# Altium schematic sheet USB3 Connector.SchDoc
size 209 x 297 mm; Author: ALTIUM GOSTBOM2.0 KEV; SheetNumber: 48; SheetTotal: 48
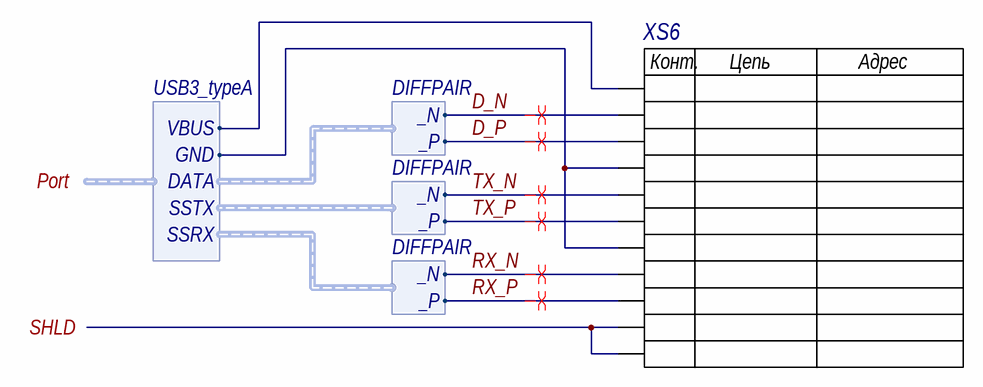
[diagram p0: USB3 Connector.SchDoc]

## Parts
XS6  10117835  [FCI-10117835_V]  (value not drawn)

## Ports
Port (harness USB3_typeA), SHLD

## Harnesses
DIFFPAIR: _P, _N
USB3_typeA: VBUS, DATA, SSTX, SSRX, GND

## Nets
D_N: XS6.2(D-) ; harness DIFFPAIR._N
D_P: XS6.3(D+) ; harness DIFFPAIR._P
RX_N: XS6.8(STDA_SSRX-) ; harness DIFFPAIR._N
RX_P: XS6.9(STDA_SSRX+) ; harness DIFFPAIR._P
SHLD: XS6.10(SHLD1) XS6.11(SHLD2) ; port SHLD
TX_N: XS6.5(STDA_SSTX-) ; harness DIFFPAIR._N
TX_P: XS6.6(STDA_SSTX+) ; harness DIFFPAIR._P
NetXS6_1: XS6.1(VBUS) ; port Port.VBUS
NetXS6_4: XS6.4(GND) XS6.7(GND-DRAIN) ; port Port.GND

## Layout directives
differential pair: D_N, D_P, RX_N, RX_P, TX_N, TX_P

## Notes on the sheet
- Подп. дата
- Инв. № дубл.
- Взам. инв. №
- Подп. и дата
- Инв. № подл.
- Изм.
- Лист
- № докум.
- Подп.
- Дата
- Файл:
- ALTIUM GOSTBOM2.0 KEV
- Копировал
- Формат А4
- (in symbol E44) Конт.; Цепь; Адрес

## Library data of the parts
XS6 = E44: USB 3.0 Standard-A Receptacle Right Angle Type Soldering to Board Termination, 30 V, -55 to 85 degC, 9-Pin THD, RoHS, Tray; Тип элемента: Соединитель; Old_des: J22; New_des: XS6; UID: E44; Component Kind: Standard; ComponentLink1Description: Manufacturer URL; ComponentLink1URL: http://portal.fciconnect.com/; ComponentLink2Description: Datasheet; ComponentLink2URL: http://portal.fciconnect.com/Comergent/fci/documentation/gs-12-0928.pdf; DatasheetVersion: Rev. B, 05/2014; Mounting Technology: Through Hole; PackageDescription: 9-Pin Through Hole Device, Body 15.6 x 16.5 mm; PackageReference: 10117835; ComponentLink3Description: Package Specification; ComponentLink3URL: http://portal.fciconnect.com/Comergent/fci/drawing/10117835.pdf; ClassName: A3